# EAGLE design 5V-to-12V-Converter-alt (EAGLE 7.2.0)
+5V to +13V Converter A cheap circuit to make +13V from a +5V supply Roman Black - orig Sep 2002 - updated Aug 2006 http://www.romanblack.com/smps/conv.htm
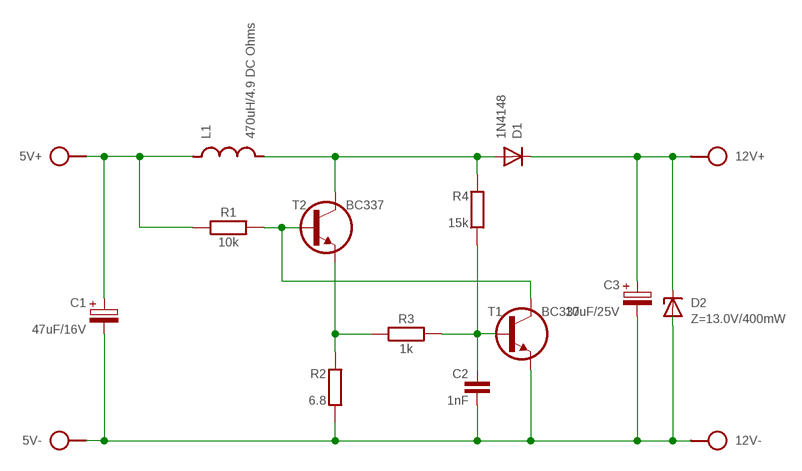
[diagram p0: schematic, sheet 1]

## Parts
5V  SPAD+--+  [SPAD-+]
12V  SPAD+--+  [SPAD-+]
C1  47uF/16V  CPOLE2,5-4/V  [E2.5-4/V]
C2  1nF  C050-020X036  [C050-020X036]
C3  10uF/25V  CPOLE2,5-4/V  [E2.5-4/V]
D1  1N4148  1N414835-2.54A  [DO35-2_54A]
D2  Z=13.0V/400mW  Z-DIODE34Z12V  [DO34Z12V]
L1  470uH/4.9 DC Ohms  L-SHORTED16-X  [ED16-X]
R1  10k  R-H0204/10  [0204/10]
R2  6.8  R0204/10  [0204/10]
R3  1k  R-H0204/10  [0204/10]
R4  15k  R0204/10  [0204/10]
T1  BC337  BC337CBE  [TO92-CBE]
T2  BC337  BC337CBE  [TO92-CBE]

## Nets
GND: 5V.1 12V.1 C1.- C2.2 C3.- D2.A R2.1 T1.E
N$3: 12V.2 C3.+ D1.C D2.C
N$5: R2.2 R3.1 T2.E
N$6: C2.1 R3.2 R4.1 T1.B
N$7: R1.2 T1.C T2.B
N$18: 5V.2 C1.+ D1.A L1.1 L1.2 R1.1 R4.2 T2.C

## Library data of the parts
5V 12V = pad:SPAD+-
C1 C3 = c:CPOL: POLARIZED CAPACITOR, European symbol
C2 = c:C: CAPACITOR, European symbol
D1 = d:1N4148
D2 = d:Z-DIODE
L1 = l:L-SHORT
R1 R3 = r:R-H
R2 R4 = r:R: RESISTOR, European symbol
T1 T2 = t:BC337

## Net classes
0 default: width 0.61 mm

## Board
+5V to +13V Converter A cheap circuit to make +13V from a +5V supply Roman Black - orig Sep 2002 - updated Aug 2006 http://www.romanblack.com/smps/conv.htm
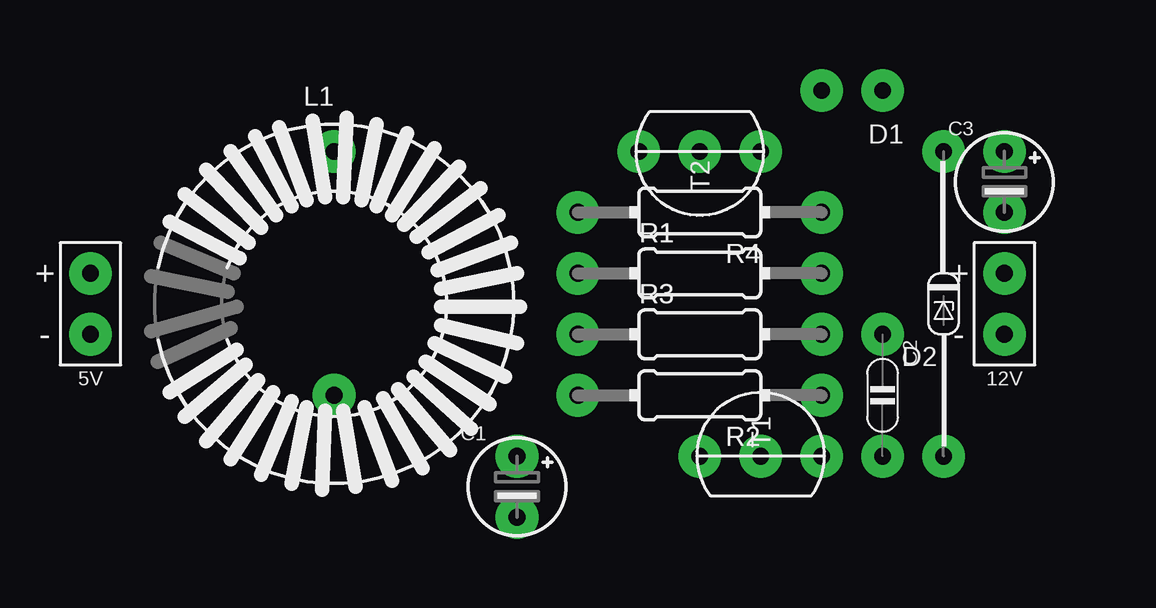
[diagram p1: board, top side]
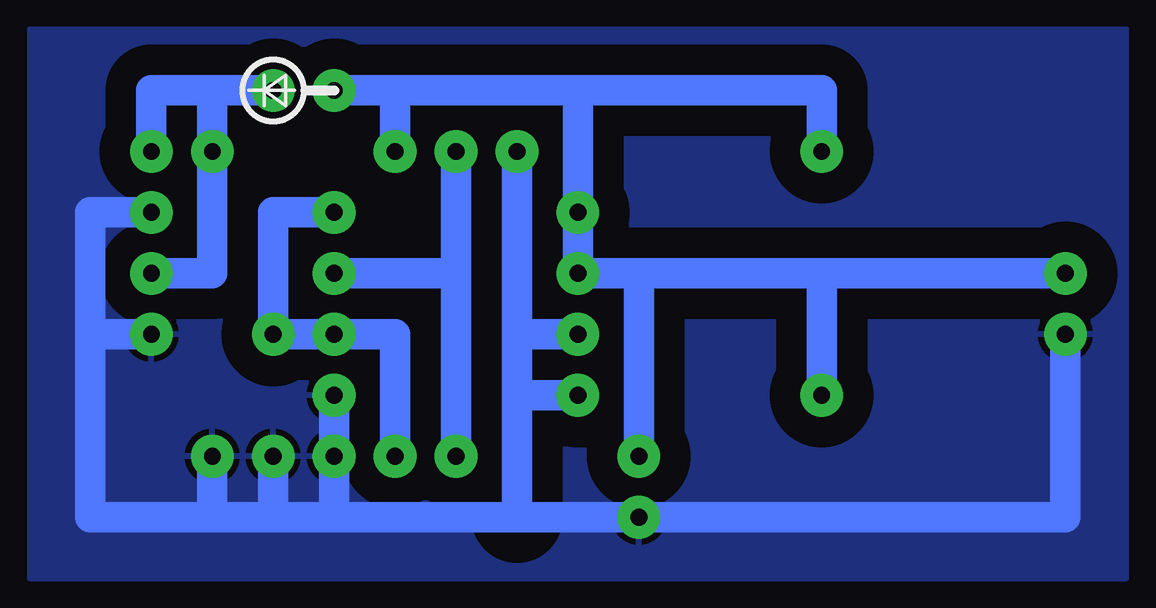
[diagram p2: board, bottom side, seen from below]

No outline drawn. Coordinates in mm, seen from the top.
Copper layers (1*16): Top 0.035mm / dielectric 1.5mm / Bottom 0.035mm
Design rules "default": minimum track width 10mil, minimum drill 24mil, track to track 8mil, track to pad 8mil, pad to pad 8mil, via to via 8mil, smd to smd 8mil, copper to edge 40mil, drill to drill 8mil, minimum pad ring 10mil, minimum via ring 8mil, stop-mask expansion 4mil, vias tented up to drill 0mil, thermal gap 10mil

### Footprints (pad centres in the part's own frame; a part is rotated, then mirrored left to right if it is on the bottom)
SPAD-+ = drill 0.7 pad 1.778: 1 0,-1.27; 2 0,1.27
E2.5-4/V = drill 0.7 pad 1.778: + 0,1.27; - 0,-1.27
C050-020X036 = drill 0.7 pad 1.778: 1 -2.54,0; 2 2.54,0
DO35-2_54A = drill 0.7 pad 1.778: A 1.27,0; C -1.27,0
DO34Z12V = drill 0.7 pad 1.778: A 0,6.35; C 0,-6.35
ED16-X = drill 0.7 pad 1.778: 1 0,-3.81; 2 0,6.35
0204/10 = drill 0.7 pad 1.778: 1 -5.08,0; 2 5.08,0
TO92-CBE = drill 0.7 pad 1.778: B 0,0; C 0,2.54; E 0,-2.54

### Placement (x,y rotation side)
5V  2.54,11.43 0 top
12V  40.64,11.43 0 top
C1  20.32,3.81 0 top
C2  35.56,7.62 270 top
C3  40.64,16.51 0 top
D1  34.29,20.32 180 top
D2  38.1,11.43 180 top
L1  12.7,11.43 0 top
R1  27.94,12.7 0 top
R2  27.94,7.62 180 top
R3  27.94,10.16 0 top
R4  27.94,15.24 180 top
T1  30.48,5.08 90 top
T2  27.94,17.78 270 top

### Tracks (layer width: path | path; a pad name or v marks a point on that pad's centre or on a via)
GND
  Bottom 1.27: 33.02,2.54 35.56,2.54 | 35.56,2.54 38.1,2.54 | 33.02,2.54 T1.E R2.1 | C2.2 35.56,2.54 | 5V.1 2.54,2.54 C1.- 33.02,2.54 | C3.- 43.18,15.24 43.18,10.16 | 38.1,2.54 43.18,2.54 43.18,10.16 | 38.1,2.54 D2.A | 12V.1 43.18,10.16
  pour Bottom (isolate 1.27): 0,22.86 45.72,22.86 45.72,0 0,0
N$3
  Bottom 1.27: D1.C 38.1,20.32 | C3.+ 40.64,20.32 38.1,20.32 | 38.1,20.32 D2.C 38.1,12.7 12V.2
N$5
  Bottom 1.27: 25.4,2.54 25.4,7.62 | 25.4,10.16 R3.1 | R2.2 25.4,7.62 | 25.4,10.16 25.4,7.62 | T2.E 25.4,10.16
N$6
  Bottom 1.27: T1.B 30.48,10.16 R3.2 C2.1 35.56,15.24 R4.1
N$7
  Bottom 1.27: 27.94,12.7 T1.C | R1.2 27.94,12.7 | 27.94,12.7 T2.B
N$18
  Bottom 1.27: L1.1 12.7,12.7 | 12.7,12.7 20.32,12.7 | 20.32,12.7 R1.1 R4.2 22.86,20.32 | C1.+ 20.32,12.7 | 5V.2 12.7,12.7 | 22.86,20.32 12.7,20.32 L1.2 | D1.A 30.48,20.32 | 30.48,20.32 22.86,20.32 | T2.C 30.48,20.32